# EAGLE design InterfaceBoard (EAGLE 8.2.1)
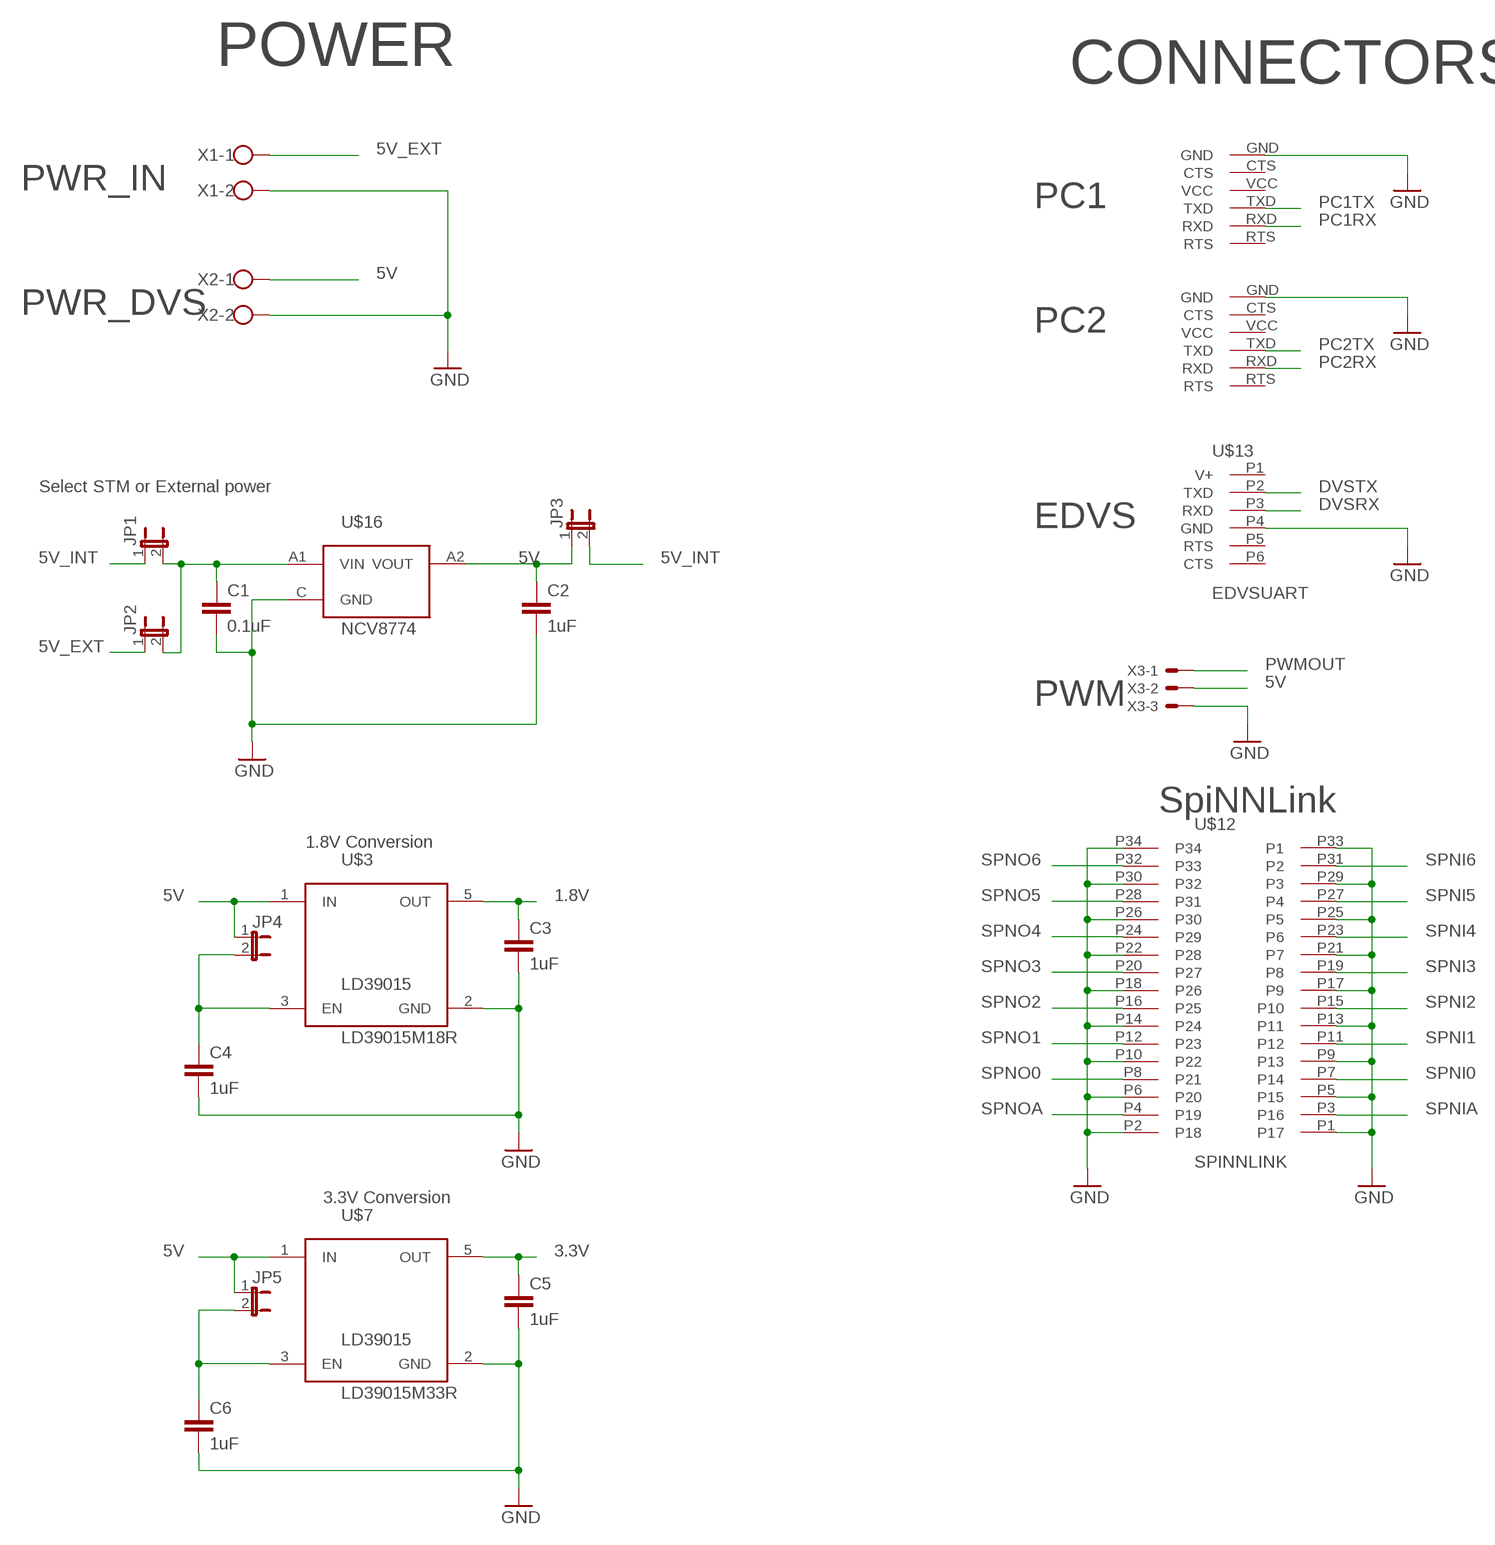
[diagram p0: schematic, sheet 1, part 1 of 2]
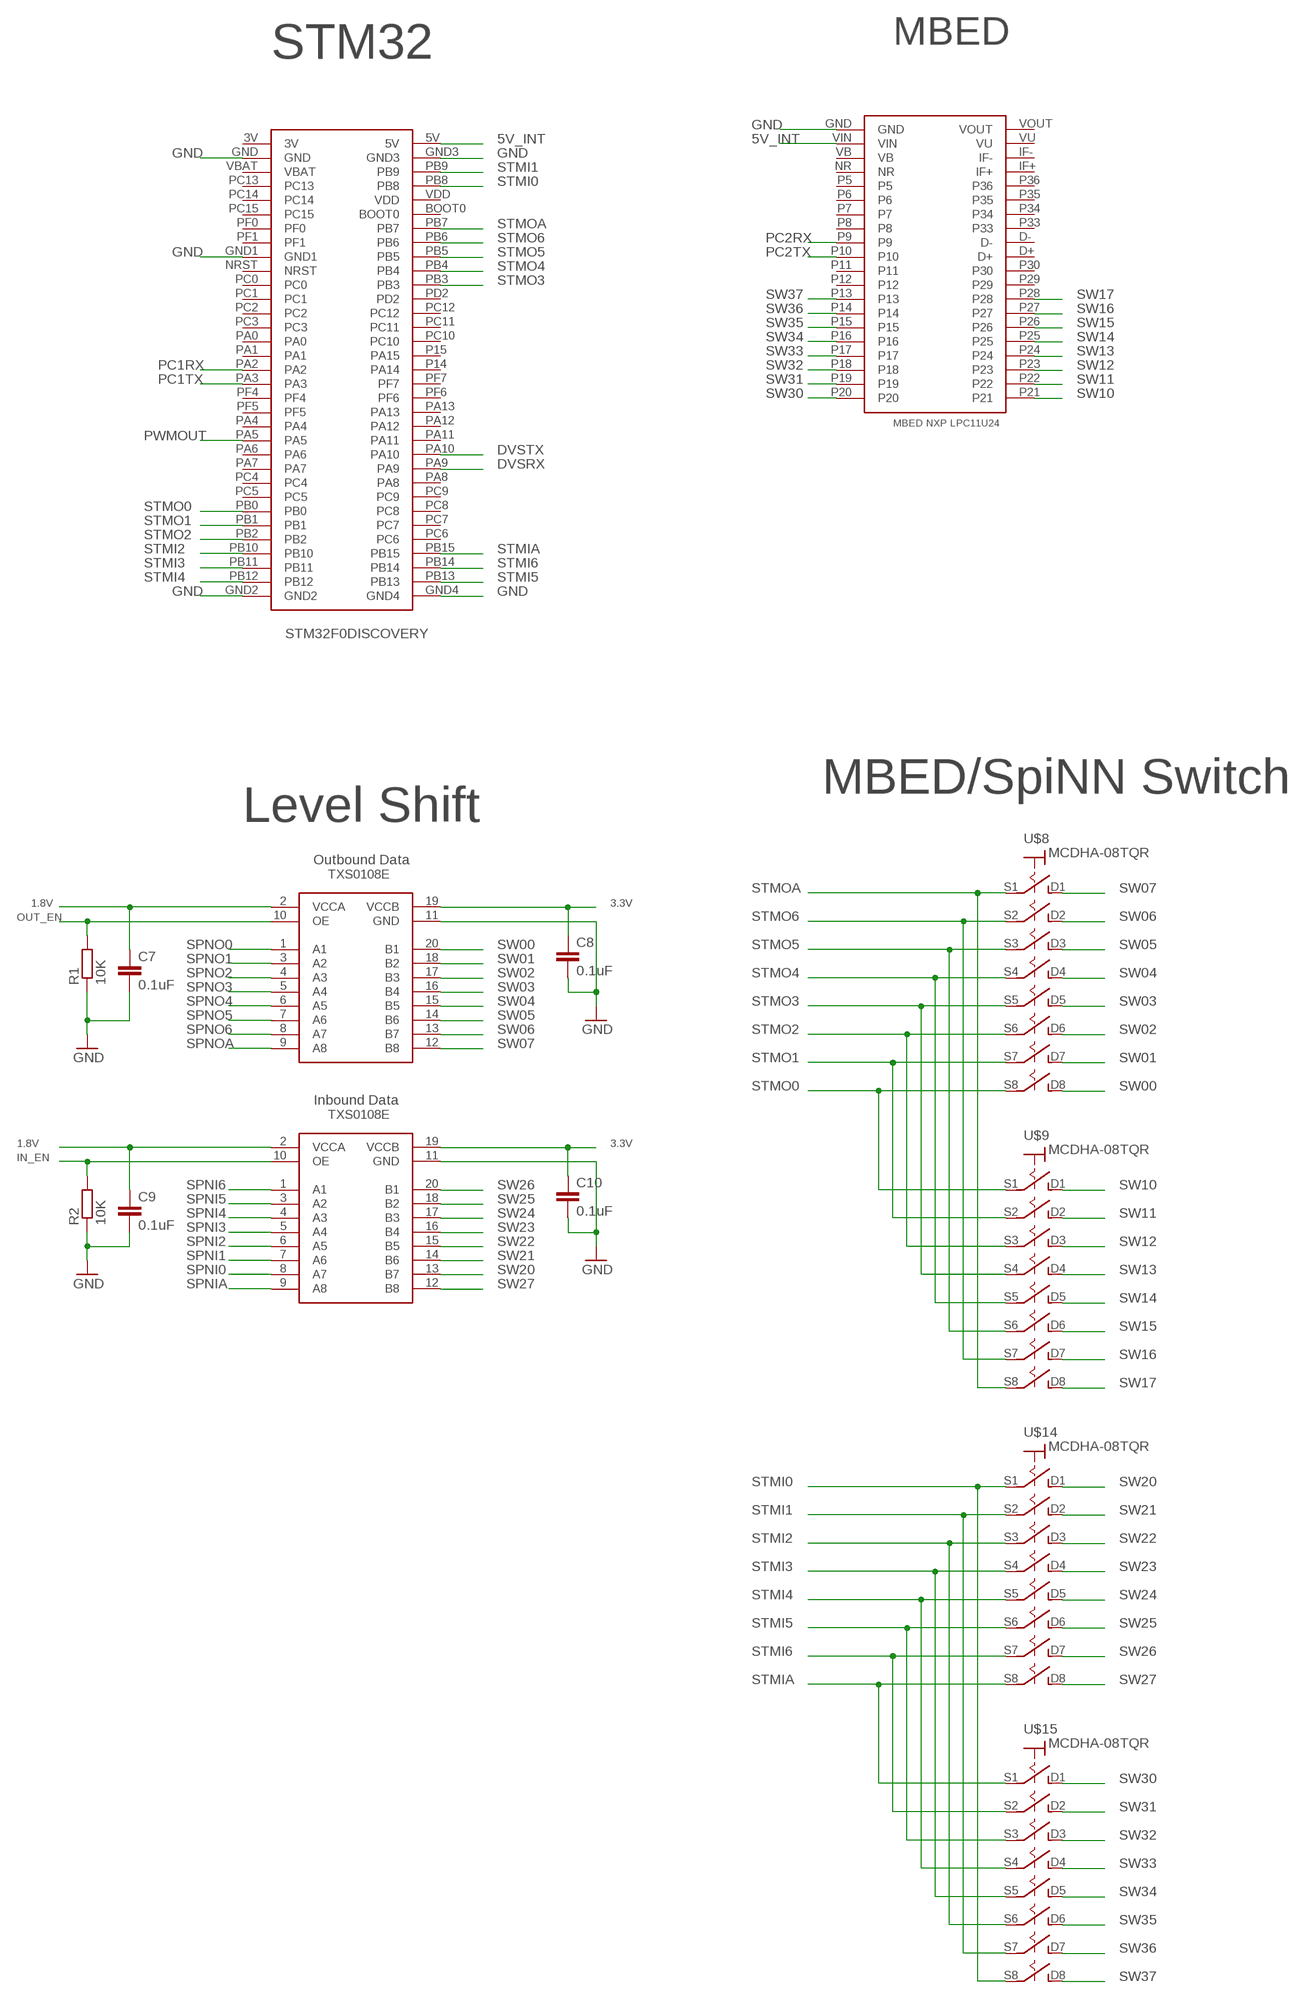
[diagram p1: schematic, sheet 1, part 2 of 2]

## Parts
C1  0.1uF  C2,5-3  [C2.5-3]
C2  1uF  C2,5-3  [C2.5-3]
C3  1uF  C2,5-3  [C2.5-3]
C4  1uF  C2,5-3  [C2.5-3]
C5  1uF  C2,5-3  [C2.5-3]
C6  1uF  C2,5-3  [C2.5-3]
C7  0.1uF  C-EU025-025X050  [C025-025X050]
C8  0.1uF  C-EU025-025X050  [C025-025X050]
C9  0.1uF  C-EU025-025X050  [C025-025X050]
C10  0.1uF  C-EU025-025X050  [C025-025X050]
JP1  JP1E  [JP1]
JP2  JP1E  [JP1]
JP3  JP1E  [JP1]
JP4  JP1E  [JP1]
JP5  JP1E  [JP1]
R1  10K  R-EU_R0805  [R0805]
R2  10K  R-EU_R0805  [R0805]
U$1  STM32F0DISCOVERY  [STM32F0DISCOVERY]
U$2  NCV8774  [DPACK_3]  (not placed on a sheet)
U$3  LD39015M18R  [SOT23-5L]
U$4  LPC11U24  [LPC11U24]
U$5  TXS0108EPWR  [TSSOP20]
U$6  TXS0108EPWR  [TSSOP20]
U$7  LD39015M33R  [SOT23-5L]
U$8  MCDHA-08TQR  [DIPSWITCH8]
U$9  MCDHA-08TQR  [DIPSWITCH8]
U$10  FTDI  [FTDIHEADER]
U$11  FTDI  [FTDIHEADER]
U$12  SPINNLINK  [C42A]
U$13  EDVSUART  [MICROMATCH8]
U$14  MCDHA-08TQR  [DIPSWITCH8]
U$15  MCDHA-08TQR  [DIPSWITCH8]
U$16  NCV8774  [DPACK_3]
X1  W237-102  [W237-102]
X2  W237-102  [W237-102]
X3  KK-156-3  [KK-156-3]

## Nets
1.8V: C3.1 C7.1 C9.1 U$3.5(OUT) U$5.2(VCCA) U$6.2(VCCA)
3.3V: C5.1 C8.1 C10.1 U$5.19(VCCB) U$6.19(VCCB) U$7.5(OUT)
5V: C2.1 JP3.1 JP4.1 JP5.1 U$3.1(IN) U$7.1(IN) U$16.A2(VOUT) X2.1 X3.2
5V_EXT: JP2.1 X1.1
5V_INT: JP1.1 JP3.2 U$1.5V U$4.VIN
DVSRX: U$1.PA9 U$13.P3(RXD)
DVSTX: U$1.PA10 U$13.P2(TXD)
GND: C1.2 C2.2 C3.2 C4.2 C5.2 C6.2 C7.2 C8.2 C9.2 C10.2 R1.1 R2.1 U$1.GND U$1.GND1 U$1.GND2 U$1.GND3 U$1.GND4 U$3.2(GND) U$4.GND U$5.11(GND) U$6.11(GND) U$7.2(GND) U$10.GND U$11.GND U$12.P1(P17) U$12.P2(P18) U$12.P5(P15) U$12.P6(P20) U$12.P9(P13) U$12.P10(P22) U$12.P13(P11) U$12.P14(P24) U$12.P17(P9) U$12.P18(P26) U$12.P21(P7) U$12.P22(P28) U$12.P25(P5) U$12.P26(P30) U$12.P29(P3) U$12.P30(P32) U$12.P33(P1) U$12.P34 U$13.P4(GND) U$16.C(GND) X1.2 X2.2 X3.3
IN_EN: R2.2 U$6.10(OE)
N$1: C1.1 JP1.2 JP2.2 U$16.A1(VIN)
N$2: C4.1 JP4.2 U$3.3(EN)
N$4: C6.1 JP5.2 U$7.3(EN)
OUT_EN: R1.2 U$5.10(OE)
PC1RX: U$1.PA2 U$10.RXD
PC1TX: U$1.PA3 U$10.TXD
PC2RX: U$4.P9 U$11.RXD
PC2TX: U$4.P10 U$11.TXD
PWMOUT: U$1.PA5 X3.1
SPNI0: U$6.8(A7) U$12.P7(P14)
SPNI1: U$6.7(A6) U$12.P11(P12)
SPNI2: U$6.6(A5) U$12.P15(P10)
SPNI3: U$6.5(A4) U$12.P19(P8)
SPNI4: U$6.4(A3) U$12.P23(P6)
SPNI5: U$6.3(A2) U$12.P27(P4)
SPNI6: U$6.1(A1) U$12.P31(P2)
SPNIA: U$6.9(A8) U$12.P3(P16)
SPNO0: U$5.1(A1) U$12.P8(P21)
SPNO1: U$5.3(A2) U$12.P12(P23)
SPNO2: U$5.4(A3) U$12.P16(P25)
SPNO3: U$5.5(A4) U$12.P20(P27)
SPNO4: U$5.6(A5) U$12.P24(P29)
SPNO5: U$5.7(A6) U$12.P28(P31)
SPNO6: U$5.8(A7) U$12.P32(P33)
SPNOA: U$5.9(A8) U$12.P4(P19)
STMI0: U$1.PB8 U$14.S1 U$15.S8
STMI1: U$1.PB9 U$14.S2 U$15.S7
STMI2: U$1.PB10 U$14.S3 U$15.S6
STMI3: U$1.PB11 U$14.S4 U$15.S5
STMI4: U$1.PB12 U$14.S5 U$15.S4
STMI5: U$1.PB13 U$14.S6 U$15.S3
STMI6: U$1.PB14 U$14.S7 U$15.S2
STMIA: U$1.PB15 U$14.S8 U$15.S1
STMO0: U$1.PB0 U$8.S8 U$9.S1
STMO1: U$1.PB1 U$8.S7 U$9.S2
STMO2: U$1.PB2 U$8.S6 U$9.S3
STMO3: U$1.PB3 U$8.S5 U$9.S4
STMO4: U$1.PB4 U$8.S4 U$9.S5
STMO5: U$1.PB5 U$8.S3 U$9.S6
STMO6: U$1.PB6 U$8.S2 U$9.S7
STMOA: U$1.PB7 U$8.S1 U$9.S8
SW00: U$5.20(B1) U$8.D8
SW01: U$5.18(B2) U$8.D7
SW02: U$5.17(B3) U$8.D6
SW03: U$5.16(B4) U$8.D5
SW04: U$5.15(B5) U$8.D4
SW05: U$5.14(B6) U$8.D3
SW06: U$5.13(B7) U$8.D2
SW07: U$5.12(B8) U$8.D1
SW10: U$4.P21 U$9.D1
SW11: U$4.P22 U$9.D2
SW12: U$4.P23 U$9.D3
SW13: U$4.P24 U$9.D4
SW14: U$4.P25 U$9.D5
SW15: U$4.P26 U$9.D6
SW16: U$4.P27 U$9.D7
SW17: U$4.P28 U$9.D8
SW20: U$6.13(B7) U$14.D1
SW21: U$6.14(B6) U$14.D2
SW22: U$6.15(B5) U$14.D3
SW23: U$6.16(B4) U$14.D4
SW24: U$6.17(B3) U$14.D5
SW25: U$6.18(B2) U$14.D6
SW26: U$6.20(B1) U$14.D7
SW27: U$6.12(B8) U$14.D8
SW30: U$4.P20 U$15.D1
SW31: U$4.P19 U$15.D2
SW32: U$4.P18 U$15.D3
SW33: U$4.P17 U$15.D4
SW34: U$4.P16 U$15.D5
SW35: U$4.P15 U$15.D6
SW36: U$4.P14 U$15.D7
SW37: U$4.P13 U$15.D8
Unconnected: U$1.3V U$1.BOOT0 U$1.NRST U$1.P14(PA14) U$1.P15(PA15) U$1.PA0 U$1.PA1 U$1.PA4 U$1.PA6 U$1.PA7 U$1.PA8 U$1.PA11 U$1.PA12 U$1.PA13 U$1.PC0 U$1.PC1 U$1.PC2 U$1.PC3 U$1.PC4 U$1.PC5 U$1.PC6 U$1.PC7 U$1.PC8 U$1.PC9 U$1.PC10 U$1.PC11 U$1.PC12 U$1.PC13 U$1.PC14 U$1.PC15 U$1.PD2 U$1.PF0 U$1.PF1 U$1.PF4 U$1.PF5 U$1.PF6 U$1.PF7 U$1.VBAT U$1.VDD U$2.A1(VIN) U$2.A2(VOUT) U$2.C(GND) U$4.D+ U$4.D- U$4.IF+ U$4.IF- U$4.NR U$4.P5 U$4.P6 U$4.P7 U$4.P8 U$4.P11 U$4.P12 U$4.P29 U$4.P30 U$4.P33 U$4.P34 U$4.P35 U$4.P36 U$4.VB U$4.VOUT U$4.VU U$10.CTS U$10.RTS U$10.VCC U$11.CTS U$11.RTS U$11.VCC U$13.P1(V+) U$13.P5(RTS) U$13.P6(CTS)

## Notes on the sheet
- POWER | CONNECTORS | STM32 | MBED
- PWR_IN
- PC1
- PWR_DVS
- PC2
- Select STM or External power
- EDVS
- PWM
- SpiNNLink
- 1.8V Conversion
- MBED/SpiNN Switch
- Level Shift
- Outbound Data
- 3.3V Conversion
- Inbound Data

## Library data of the parts
C1-C6 = capacitor-wima:C: CAPACITOR naming: grid - package width
C7-C10 = rcl:C-EU: CAPACITOR, European symbol
JP1-JP5 = jumper:JP1E: JUMPER
R1 R2 = rcl:R-EU_: RESISTOR, European symbol
U$1 = InterfaceParts:STM32F0DISCOVERY: STM32F0DISCOVERY Evaluation Board Data Sheet <http://www.st.com/content/ccc/resource/technical/document/user_manual/30/ae/6e/54/d3/b6/46/17/DM00050135.pdf/files/DM00050135.pdf/jcr:content/translations/en.DM00050135.pdf>
U$2 U$16 = InterfaceParts:NCV8774
U$3 = InterfaceParts:LD39015M18R
U$4 = InterfaceParts:LPC11U24
U$5 U$6 = InterfaceParts:TXS0108EPWR
U$7 = InterfaceParts:LD39015M33R
U$8 U$9 U$14 U$15 = InterfaceParts:MCDHA-08TQR
U$10 U$11 = InterfaceParts:FTDI
U$12 = InterfaceParts:SPINNLINK
U$13 = InterfaceParts:EDVSUART
X1 X2 = con-wago-500:W237-102: WAGO SCREW CLAMP; MPN: 237-102; OC_FARNELL: unknown; OC_NEWARK: 70K9898
X3 = con-molex:KK-156-3: KK 156 HEADER Source: http://www.molex.com/pdm_docs/sd/026604100_sd.pdf; OC_FARNELL: unknown; OC_NEWARK: unknown

## Board
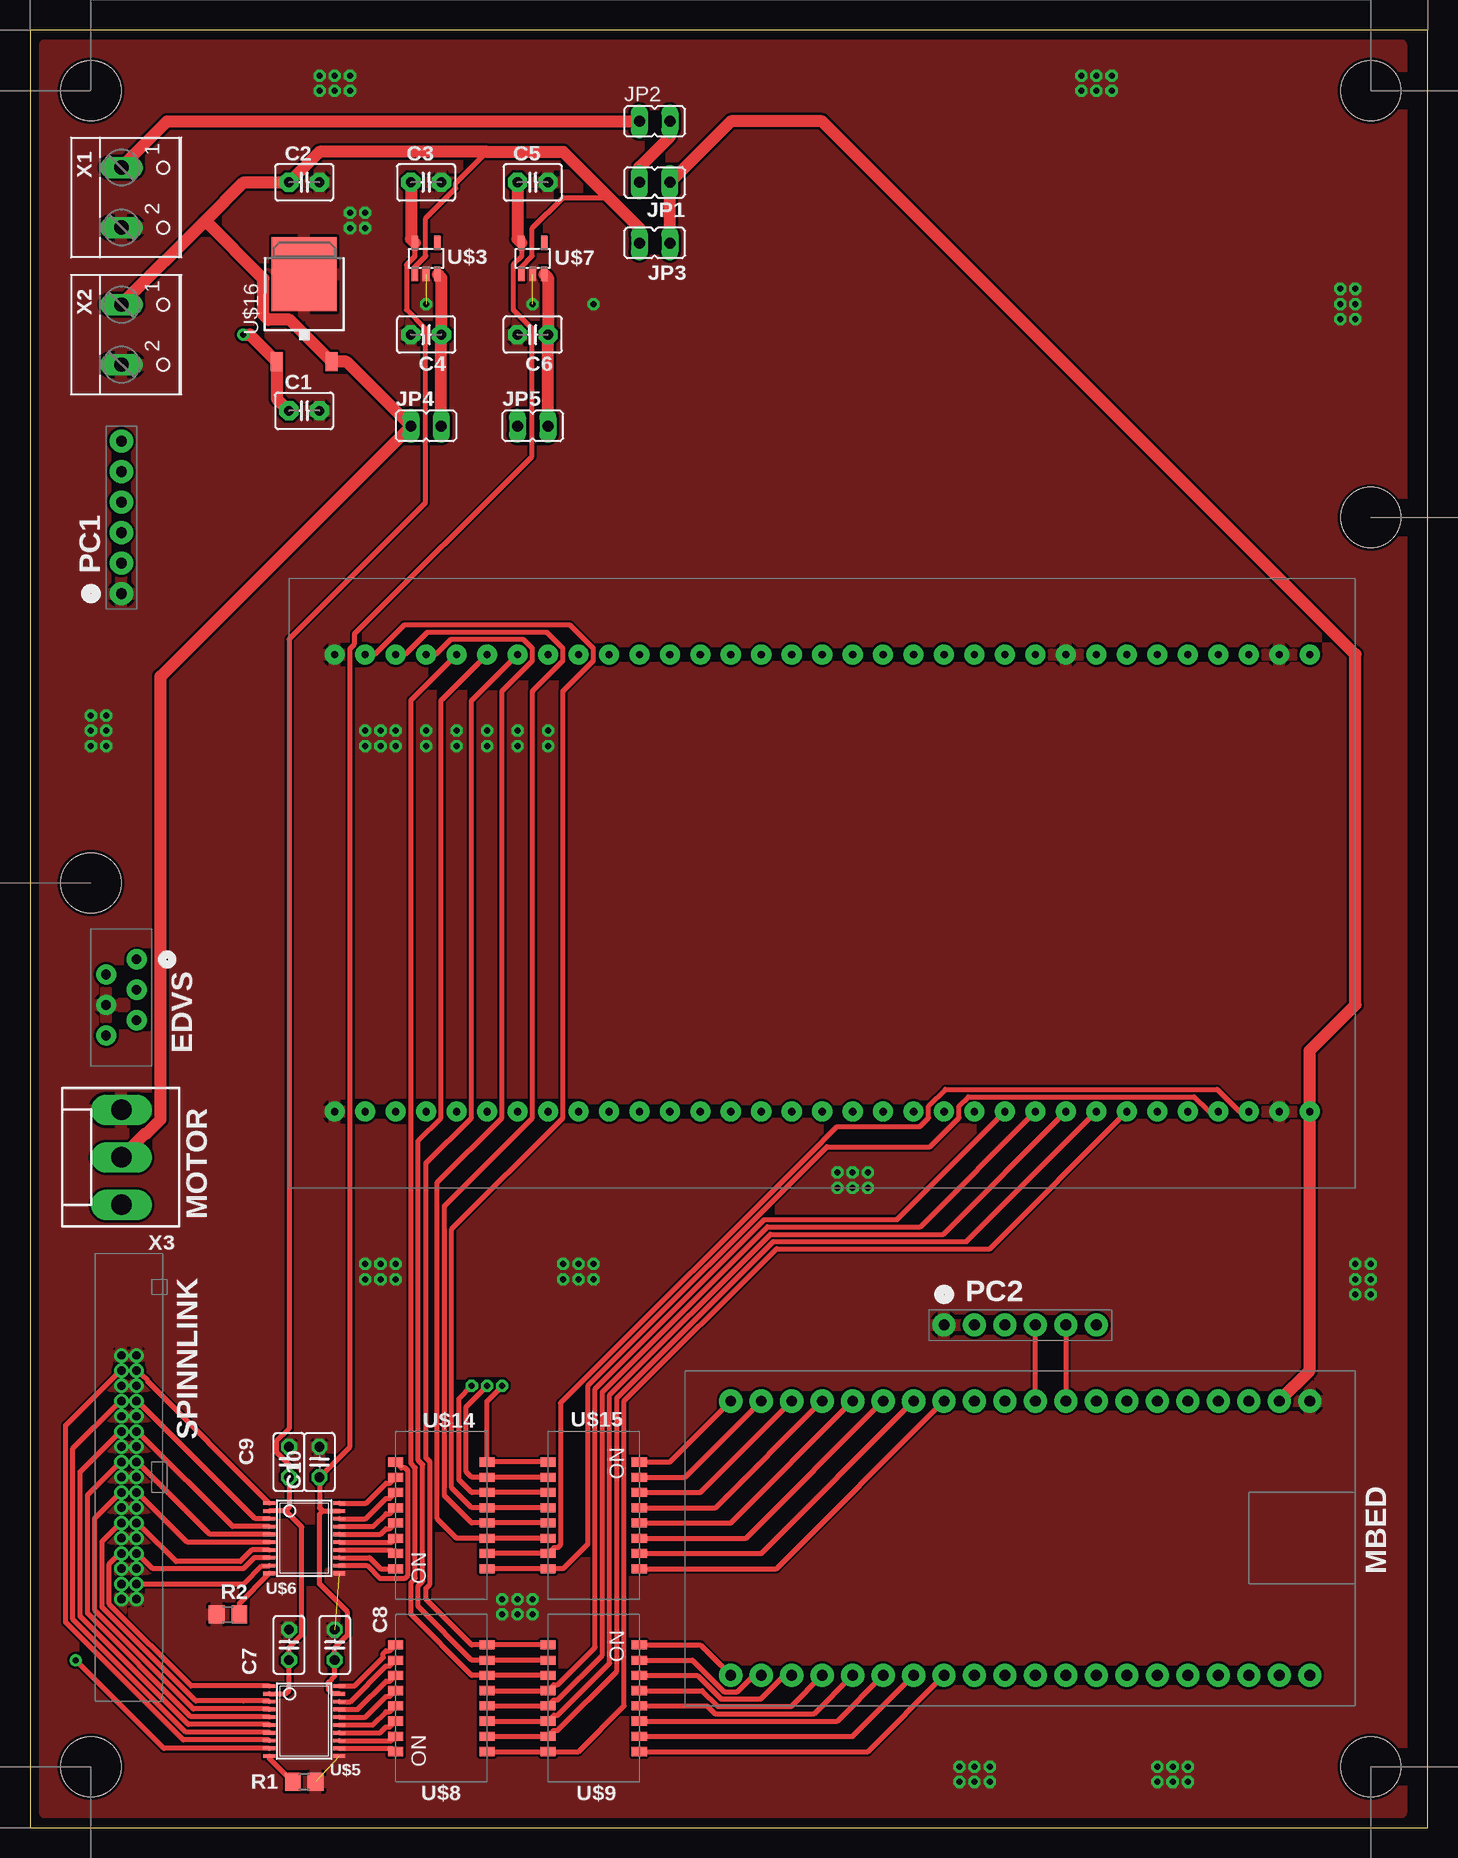
[diagram p2: board, top side]
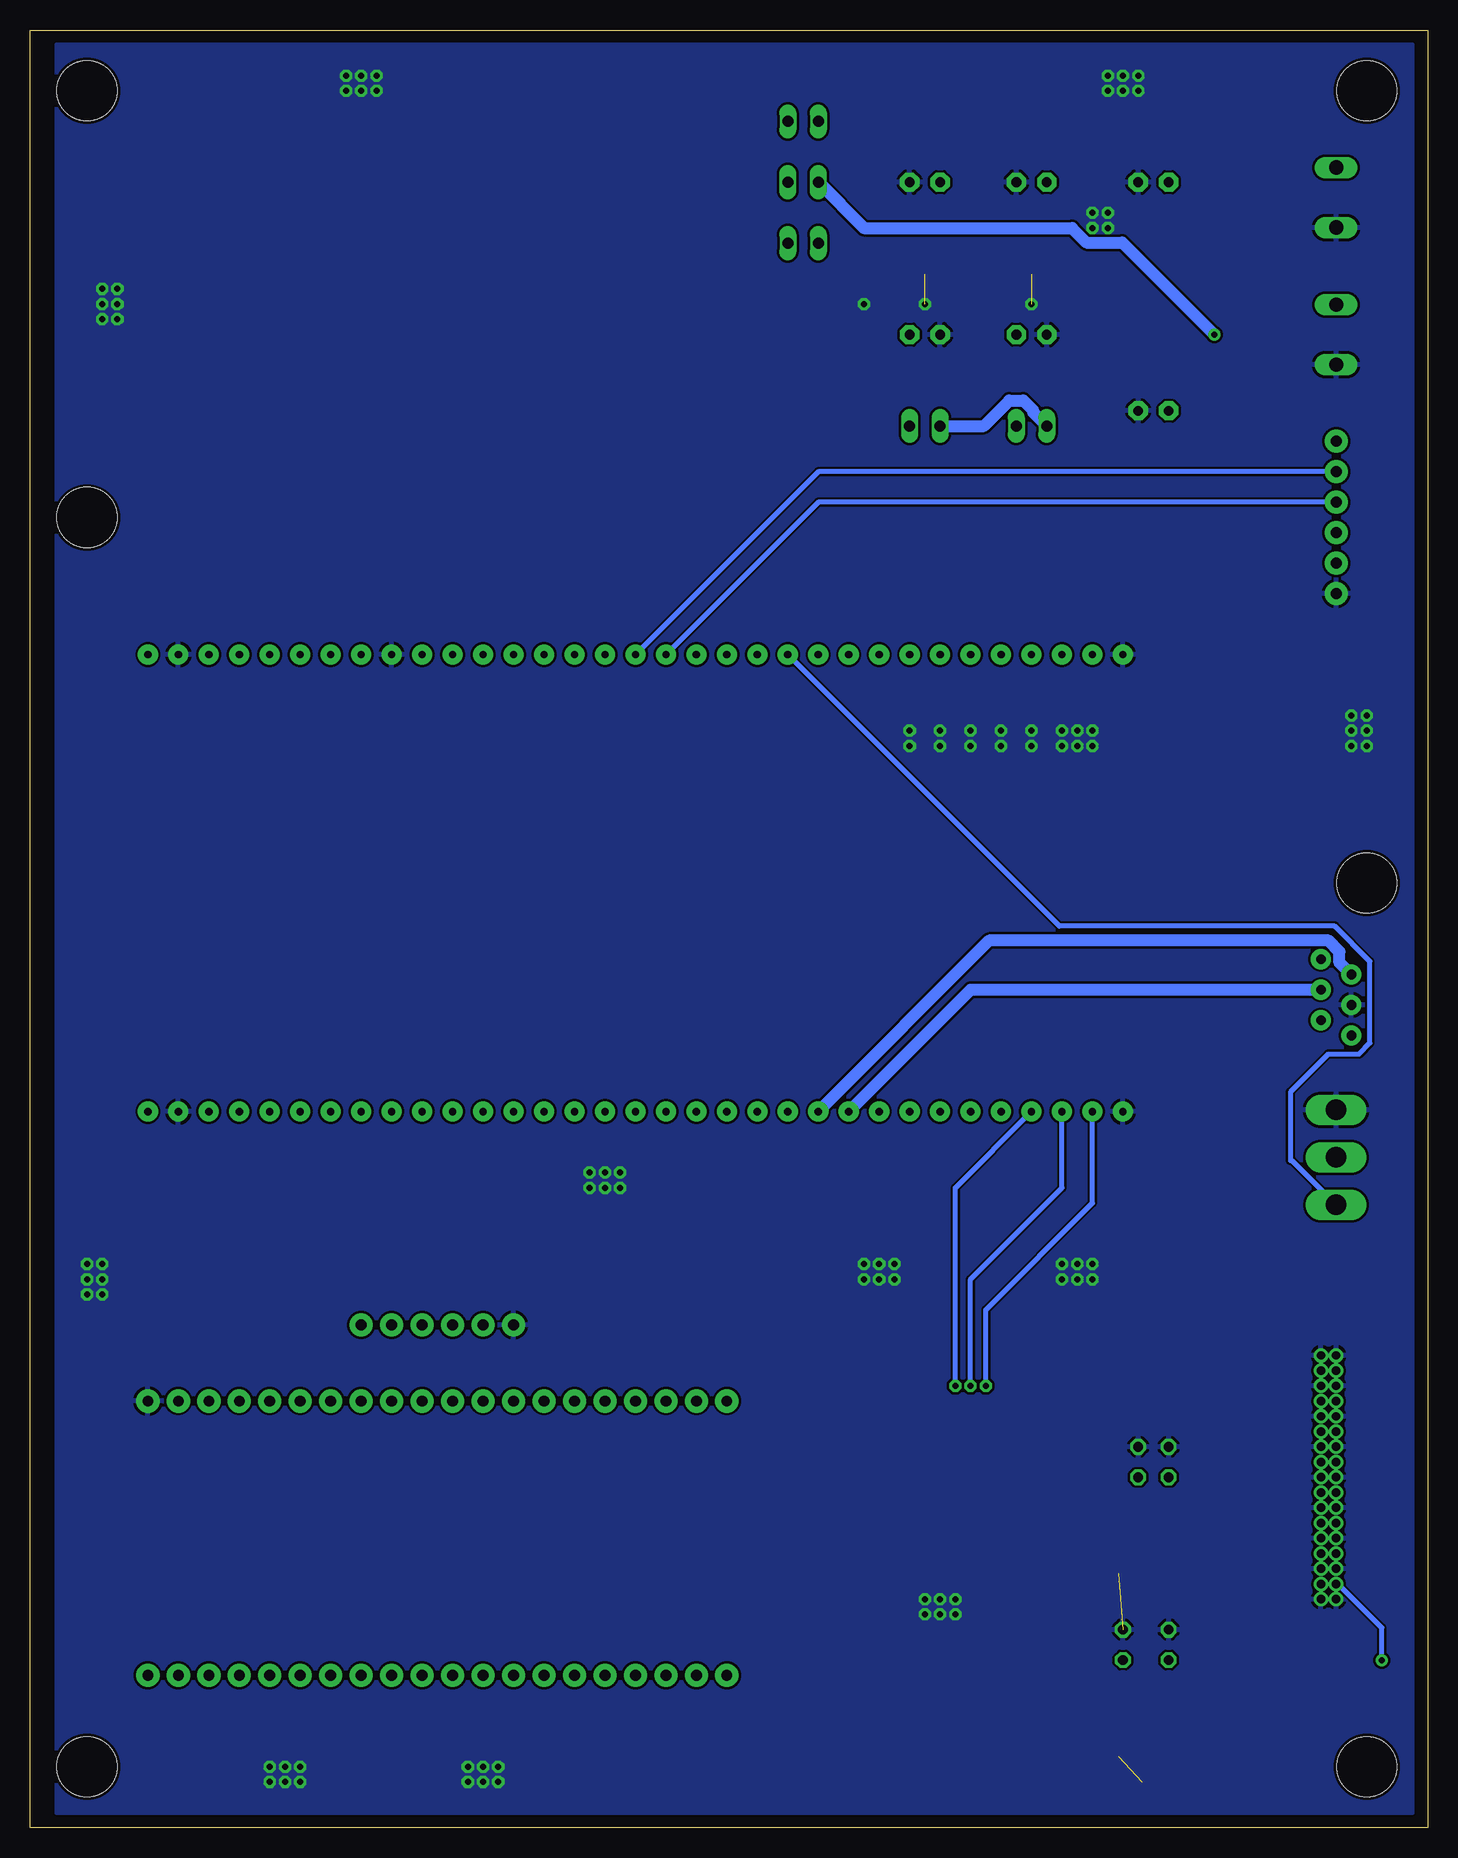
[diagram p3: board, bottom side, seen from below]

Size 116.51 x 149.85 mm. Coordinates in mm from the lower left corner, seen from the top.
Outline: 0,0 116.51,0 116.51,149.85 0,149.85 0,0
Copper layers (1*16): Top 0.035mm / dielectric 1.5mm / Bottom 0.035mm
Design rules "PCBTrain": minimum track width 0.2mm, minimum drill 0.4mm, track to track 0.2mm, track to pad 0.2mm, pad to pad 0.2mm, via to via 0.2mm, smd to smd 0mil, copper to edge 10mil, drill to drill 0.2mm, minimum pad ring 10mil, minimum via ring 10mil, stop-mask expansion 0.125mm, vias tented up to drill 0mil, thermal gap 10mil
Holes 5 mm at 5.08,144.78 5.08,5.08 5.08,78.74 111.76,5.08 111.76,144.78 111.76,109.22

### Footprints (pad centres in the part's own frame; a part is rotated, then mirrored left to right if it is on the bottom)
C2.5-3 = drill 0.813 pad 1.6 octagon: 1 -1.27,0; 2 1.27,0
C025-025X050 = drill 0.813 octagon: 1 -1.27,0; 2 1.27,0
JP1 = drill 0.914 long: 1 0,-1.27; 2 0,1.27
R0805 = smd 1.3 x 1.5: 1 -0.95,0; 2 0.95,0
STM32F0DISCOVERY = drill 0.6 pad 1.676: 3V -20.32,40.64; 5V 17.78,40.64; BOOT0 17.78,27.94; GND 17.78,-40.64; GND1 -20.32,38.1; GND2 -20.32,20.32; GND3 -20.32,-40.64; GND4 17.78,38.1; NRST -20.32,17.78; P14 17.78,0; P15 17.78,2.54; PA0 -20.32,5.08; PA1 -20.32,2.54; PA2 -20.32,0; PA3 -20.32,-2.54; PA4 -20.32,-10.16; PA5 -20.32,-12.7; PA6 -20.32,-15.24; PA7 -20.32,-17.78; PA8 17.78,-20.32; PA9 17.78,-17.78; PA10 17.78,-15.24; PA11 17.78,-12.7; PA12 17.78,-10.16; PA13 17.78,-7.62; PB0 -20.32,-25.4; PB1 -20.32,-27.94; PB2 -20.32,-30.48; PB3 17.78,15.24; PB4 17.78,17.78; PB5 17.78,20.32; PB6 17.78,22.86; PB7 17.78,25.4; PB8 17.78,33.02; PB9 17.78,35.56; PB10 -20.32,-33.02; PB11 -20.32,-35.56; PB12 -20.32,-38.1; PB13 17.78,-38.1; PB14 17.78,-35.56; PB15 17.78,-33.02; PC0 -20.32,15.24; PC1 -20.32,12.7; PC2 -20.32,10.16; PC3 -20.32,7.62; PC4 -20.32,-20.32; PC5 -20.32,-22.86; PC6 17.78,-30.48; PC7 17.78,-27.94; PC8 17.78,-25.4; PC9 17.78,-22.86; PC10 17.78,5.08; PC11 17.78,7.62; PC12 17.78,10.16; PC13 -20.32,33.02; PC14 -20.32,30.48; PC15 -20.32,27.94; PD2 17.78,12.7; PF0 -20.32,25.4; PF1 -20.32,22.86; PF4 -20.32,-5.08; PF5 -20.32,-7.62; PF6 17.78,-5.08; PF7 17.78,-2.54; VBAT -20.32,35.56; VDD 17.78,30.48
SOT23-5L = smd 0.55 x 1.2: 1 -0.95,-1.3; 2 0,-1.3; 3 0.95,-1.3; 4 0.95,1.3; 5 -0.95,1.3
LPC11U24 = drill 0.9 pad 1.93: D+ 11.43,1.27; D- 11.43,3.81; GND -11.43,24.13; IF+ 11.43,16.51; IF- 11.43,19.05; NR -11.43,16.51; P5 -11.43,13.97; P6 -11.43,11.43; P7 -11.43,8.89; P8 -11.43,6.35; P9 -11.43,3.81; P10 -11.43,1.27; P11 -11.43,-1.27; P12 -11.43,-3.81; P13 -11.43,-6.35; P14 -11.43,-8.89; P15 -11.43,-11.43; P16 -11.43,-13.97; P17 -11.43,-16.51; P18 -11.43,-19.05; P19 -11.43,-21.59; P20 -11.43,-24.13; P21 11.43,-24.13; P22 11.43,-21.59; P23 11.43,-19.05; P24 11.43,-16.51; P25 11.43,-13.97; P26 11.43,-11.43; P27 11.43,-8.89; P28 11.43,-6.35; P29 11.43,-3.81; P30 11.43,-1.27; P33 11.43,6.35; P34 11.43,8.89; P35 11.43,11.43; P36 11.43,13.97; VB -11.43,19.05; VIN -11.43,21.59; VOUT 11.43,24.13; VU 11.43,21.59
TSSOP20 = smd 0.305 x 0.991: 1 -2.925,-2.918; 2 -2.275,-2.918; 3 -1.625,-2.918; 4 -0.975,-2.918; 5 -0.325,-2.918; 6 0.325,-2.918; 7 0.975,-2.918; 8 1.625,-2.918; 9 2.275,-2.918; 10 2.925,-2.918; 11 2.925,2.918; 12 2.275,2.918; 13 1.625,2.918; 14 0.975,2.918; 15 0.325,2.918; 16 -0.325,2.918; 17 -0.975,2.918; 18 -1.625,2.918; 19 -2.275,2.918; 20 -2.925,2.918
DIPSWITCH8 = smd 0.76 x 1.27: D1 -3.81,3.81; D2 -2.54,3.81; D3 -1.27,3.81; D4 0,3.81; D5 1.27,3.81; D6 2.54,3.81; D7 3.81,3.81; D8 5.08,3.81; S1 -3.81,-3.81; S2 -2.54,-3.81; S3 -1.27,-3.81; S4 0,-3.81; S5 1.27,-3.81; S6 2.54,-3.81; S7 3.81,-3.81; S8 5.08,-3.81
FTDIHEADER = drill 0.9 pad 1.93: CTS 3.81,0; GND 6.35,0; RTS -6.35,0; RXD -3.81,0; TXD -1.27,0; VCC 1.27,0
C42A = drill 0.7 pad 0.95: P1 10.16,1.27; P2 10.16,0; P3 8.89,1.27; P4 8.89,0; P5 7.62,1.27; P6 7.62,0; P7 6.35,1.27; P8 6.35,0; P9 5.08,1.27; P10 5.08,0; P11 3.81,1.27; P12 3.81,0; P13 2.54,1.27; P14 2.54,0; P15 1.27,1.27; P16 1.27,0; P17 0,1.27; P18 0,0; P19 -1.27,1.27; P20 -1.27,0; P21 -2.54,1.27; P22 -2.54,0; P23 -3.81,1.27; P24 -3.81,0; P25 -5.08,1.27; P26 -5.08,0; P27 -6.35,1.27; P28 -6.35,0; P29 -7.62,1.27; P30 -7.62,0; P31 -8.89,1.27; P32 -8.89,0; P33 -10.16,1.27; P34 -10.16,0
MICROMATCH8 = drill 0.8 pad 1.676: P1 5.08,-2.54; P2 3.81,0; P3 2.54,-2.54; P4 1.27,0; P5 0,-2.54; P6 -1.27,0
DPACK_3 = smd 1 x 1.6: A1 -2.28,-4.8; A2 2.28,-4.8 | smd 5.4 x 6.2: C 0,2.5
W237-102 = drill 1.194 long: 1 -2.5,-1.27; 2 2.5,-1.27
KK-156-3 = drill 1.7 pad 2.184 long: 1 -3.96,0; 2 0,0; 3 3.96,0

### Placement (x,y rotation side)
C1  22.86,118.11 0 top
C2  22.86,137.16 0 top
C3  33.02,137.16 0 top
C4  33.02,124.46 180 top
C5  41.91,137.16 0 top
C6  41.91,124.46 180 top
C7  21.59,15.24 90 top
C8  25.4,15.24 90 top
C9  21.59,30.48 90 top
C10  24.13,30.48 90 top
JP1  52.07,137.16 90 top
JP2  52.07,142.24 270 top
JP3  52.07,132.08 270 top
JP4  33.02,116.84 270 top
JP5  41.91,116.84 270 top
R1  22.86,3.81 180 top
R2  16.51,17.78 0 top
U$1  66.04,77.47 270 top
U$3  33.02,130.81 0 top
U$4  82.55,24.13 270 top
U$5  22.86,8.89 270 top
U$6  22.86,24.13 270 top
U$7  41.91,130.81 0 top
U$8  34.29,10.16 90 top
U$9  46.99,11.43 270 top
U$10  7.62,109.22 270 top
U$11  82.55,41.91 180 top
U$12  7.62,29.21 270 top
U$13  6.35,67.31 90 top
U$14  34.29,25.4 90 top
U$15  46.99,26.67 270 top
U$16  22.86,127 0 top
X1  8.89,135.89 270 top
X2  8.89,124.46 270 top
X3  7.62,55.88 90 top

### Tracks (layer width: path | path; a pad name or v marks a point on that pad's centre or on a via)
1.8V
  Top 0.406: 21.32,26.41 U$6.2 | 21.32,26.41 21.59,26.67 C9.1 21.59,30.25 20.53,31.31 20.53,32.19 21.59,33.25 21.59,99.06 32.95,110.42 32.95,124.96 31.39,126.52 31.39,130.28 32.07,130.96 U$3.5 | U$5.2 21.32,11.16 21.59,11.43 C7.1 21.59,15.01 22.65,16.07 22.65,25.08 21.32,26.41
  Top 1.016: C3.1 31.75,132.43 U$3.5
3.3V
  Top 0.406: 24.39,26.41 U$6.19 | 24.39,26.41 24.13,26.67 C10.1 26.67,31.75 26.67,98.28 27.06,98.67 27.06,99.52 41.84,114.3 41.84,124.96 40.28,126.52 40.28,130.28 40.96,130.96 U$7.5 | 24.39,26.41 24.13,26.14 24.13,20.32 26.46,17.99 26.46,16.07 25.4,15.01 C8.1 25.4,12.65 24.88,12.13 24.88,11.5 25.21,11.16 U$5.19
  Top 1.016: C5.1 40.64,132.43 U$7.5
5V
  Top 0.406: U$3.1 32.07,130.1 32.98,131.01 32.98,134.15 35.49,136.66 35.49,137.09 38.1,139.7 | U$7.1 40.96,130.1 41.87,131.01 41.87,133.31 44.45,135.89 48.26,135.89
  Top 1.016: JP3.1 50.8,133.35 48.26,135.89 44.45,139.7 38.1,139.7 24.13,139.7 C2.1 17.82,137.16 14.62,133.97 | 14.62,133.97 X2.1 | X3.2 9.6,57.86 9.72,57.86 10.88,59.02 10.88,95.97 JP4.1 26.39,122.2 U$16.A2 21.65,125.69 19.87,125.69 19.45,126.11 19.45,129.14 14.62,133.97
  Bottom 1.016: JP5.1 37.01,116.84 34.88,118.97 33.7,118.97 32.87,118.14 32.87,117.96 JP4.1
5V_EXT
  Top 1.016: X1.1 7.62,138.43 11.43,142.24 JP2.1
5V_INT
  Top 1.016: JP3.2 JP1.1 58.42,142.24 66.04,142.24 110.49,97.79 110.49,68.58 106.68,64.77 U$1.5V 106.68,38.1 U$4.VIN
DVSRX
  Bottom 1.016: U$13.P3 38.1,69.85 U$1.PA9
DVSTX
  Bottom 1.016: U$13.P2 7.34,72.11 7.34,73.03 8.25,73.94 36.55,73.94 U$1.PA10
GND  (via drill 0.5)  (4 unrouted)
  other vias: 46.99,127 26.67,133.35 26.67,134.62 27.94,134.62 27.94,133.35 33.02,127 41.91,127 44.45,46.99 45.72,46.99 46.99,46.99 44.45,45.72 45.72,45.72 46.99,45.72 29.21,46.99 30.48,46.99 27.94,46.99 27.94,45.72 30.48,45.72 29.21,45.72 29.21,91.44 30.48,91.44 30.48,90.17 29.21,90.17 27.94,90.17 27.94,91.44 67.31,54.61 68.58,54.61 69.85,54.61 69.85,53.34 68.58,53.34 67.31,53.34 33.02,91.44 33.02,90.17 35.56,90.17 35.56,91.44 38.1,90.17 38.1,91.44 40.64,90.17 40.64,91.44 43.18,90.17 43.18,91.44 39.37,19.05 40.64,19.05 41.91,19.05 39.37,17.78 40.64,17.78 41.91,17.78 77.47,5.08 78.74,5.08 80.01,5.08 77.47,3.81 78.74,3.81 80.01,3.81 93.98,5.08 95.25,5.08 96.52,5.08 93.98,3.81 95.25,3.81 96.52,3.81 110.49,44.45 110.49,45.72 110.49,46.99 111.76,44.45 111.76,45.72 111.76,46.99 109.22,125.73 109.22,127 109.22,128.27 110.49,125.73 110.49,127 110.49,128.27 90.17,144.78 88.9,144.78 87.63,144.78 90.17,146.05 88.9,146.05 87.63,146.05 24.13,146.05 25.4,146.05 26.67,146.05 24.13,144.78 25.4,144.78 26.67,144.78 5.08,92.71 5.08,91.44 5.08,90.17 6.35,92.71 6.35,91.44 6.35,90.17
  pour Top: 1.27,148.59 114.3,148.59 114.3,1.27 1.27,1.27
  pour Bottom: 1.27,148.59 114.3,148.59 114.3,1.27 1.27,1.27
IN_EN
  Top 0.406: R2.2 17.46,18.72 U$6.10
N$1  (via drill 0.5)
  Top 1.016: JP2.2 53.34,140.97 50.8,138.43 JP1.2 | v17.78,124.46 18.32,124.46 U$16.A1 20.58,119.12 C1.1
  Bottom 1.016: JP1.2 46.99,133.35 29.65,133.35 28.44,132.14 25.46,132.14 v17.78,124.46
N$2
  Top 0.406: U$3.3 34.29,129.19
  Top 1.016: 34,129.48 34.29,129.19 C4.1 JP4.2
N$4
  Top 0.406: U$7.3 43.18,129.19
  Top 1.016: 42.89,129.48 43.18,129.19 C6.1 JP5.2
OUT_EN
  Top 0.406: U$5.10 19.94,5.78 R1.2
PC1RX
  Bottom 0.406: U$10.RXD 50.8,113.03 U$1.PA2
PC1TX
  Bottom 0.406: U$10.TXD 50.8,110.49 U$1.PA3
PC2RX
  Top 0.406: U$11.RXD U$4.P9
PC2TX
  Top 0.406: U$4.P10 U$11.TXD
PWMOUT
  Bottom 0.406: U$1.PA5 30.7,75.15 7.75,75.15 4.8,72.21 4.8,65.4 5.71,64.49 8.26,64.49 11.43,61.32 11.43,55.61 11.31,55.61 X3.1
SPNI0
  Top 0.406: U$6.8 18.7,22.5 17.78,21.59 10.24,21.59 9.29,22.55 9.2,22.55 U$12.P7
SPNI1
  Top 0.406: U$6.7 18.49,23.16 17.53,22.2 12.18,22.2 9.29,25.09 9.2,25.09 U$12.P11
SPNI2
  Top 0.406: U$12.P15 9.2,27.63 9.29,27.63 13.11,23.8 U$6.6
SPNI3
  Top 0.406: U$12.P19 9.2,30.17 9.29,30.17 15,24.45 U$6.5
SPNI4
  Top 0.406: U$12.P23 9.2,32.71 9.29,32.71 16.89,25.11 U$6.4
SPNI5
  Top 0.406: U$12.P27 9.2,35.25 9.29,35.25 18.78,25.75 U$6.3
SPNI6
  Top 0.406: U$12.P31 9.2,37.79 9.29,37.79 9.85,37.23 9.85,37.15 U$6.1
SPNIA
  Top 0.406: U$6.9 19.9,21.81 19.33,21.81 17.84,20.32 U$12.P3
SPNO0
  Top 0.406: U$12.P8 7.36,22.6 7.2,22.6 6.61,22.01 6.61,18.63 13.43,11.81 U$5.1
SPNO1
  Top 0.406: U$5.3 19.9,10.56 17.78,10.56 13.83,10.56 6.01,18.38 6.01,23.87 7.22,25.09 7.31,25.09 U$12.P12
SPNO2
  Top 0.406: U$5.4 19.9,9.91 13.62,9.91 5.4,18.13 5.4,25.8 7.22,27.63 7.31,27.63 U$12.P16
SPNO3
  Top 0.406: U$5.5 19.9,9.26 13.41,9.26 4.79,17.88 4.79,27.74 7.22,30.17 7.31,30.17 U$12.P20
SPNO4
  Top 0.406: U$5.6 19.9,8.61 13.21,8.61 4.19,17.63 4.19,29.67 7.22,32.71 7.31,32.71 U$12.P24
SPNO5
  Top 0.406: U$5.7 19.9,7.96 13,7.96 3.58,17.38 3.58,31.6 7.22,35.25 7.31,35.25 U$12.P28
SPNO6
  Top 0.406: U$5.8 19.9,7.31 12.79,7.31 2.97,17.13 2.97,33.54 7.22,37.79 7.31,37.79 U$12.P32
SPNOA  (via drill 0.5)
  Top 0.406: U$5.9 11.16,6.62 v3.81,13.97
  Bottom 0.406: U$12.P4 7.36,20.06 7.2,20.06 3.81,16.66 v3.81,13.97
STMI0
  Top 0.406: U$14.S1 U$15.S8 44.45,21.59 46.5,23.64 46.5,36.82 66.44,56.75 | U$1.PB8 98.28,59.69 97.03,60.93 78.23,60.93 77.44,60.15 77.44,59.18 75.02,56.75 66.44,56.75 | 66.45,56.77 66.44,56.75
STMI1
  Top 0.406: U$14.S2 U$15.S7 43.67,23.35 43.98,23.35 44.22,23.58 44.22,35.39 66.01,57.18 | 66.2,57.37 66.01,57.18 | U$1.PB9 100.82,59.69 98.97,61.54 76.29,61.54 74.9,60.15 74.9,59.18 74.17,58.45 67.27,58.45 66.2,57.37 | 66.01,57.18 66.2,57.37
STMI2
  Top 0.406: U$15.S6 U$14.S3 35.56,24.13 33.94,25.75 33.94,53.78 39.34,59.18 39.34,94.74 41.88,97.28 41.88,98.3 41.15,99.03 35.05,99.03 33.8,97.79 U$1.PB10
STMI3
  Top 0.406: U$15.S5 U$14.S4 36.83,25.4 34.55,27.68 34.55,51.84 41.88,59.18 41.88,94.74 44.42,97.28 44.42,98.3 43.09,99.64 33.11,99.64 31.26,97.79 U$1.PB11
STMI4
  Top 0.406: U$15.S4 U$14.S5 36.83,26.67 35.16,28.34 35.16,49.91 44.42,59.18 44.42,94.74 46.96,97.28 46.96,98.3 45.02,100.24 31.18,100.24 28.72,97.79 U$1.PB12
STMI5  (via drill 0.5)
  Top 0.406: U$15.S3 U$14.S6 36.83,27.94 35.76,29.01 35.76,35.76 v36.83,36.83
  Bottom 0.406: v36.83,36.83 36.83,43.18 27.94,52.07 U$1.PB13
STMI6  (via drill 0.5)
  Top 0.406: U$15.S2 U$14.S7 36.83,29.21 36.37,29.67 36.37,35.09 37.74,36.45 37.74,36.47 v38.1,36.83
  Bottom 0.406: v38.1,36.83 38.1,45.72 30.48,53.34 U$1.PB14
STMIA  (via drill 0.5)
  Top 0.406: U$15.S1 U$14.S8 38.1,35.55 39.01,36.45 39.01,36.47 v39.37,36.83
  Bottom 0.406: v39.37,36.83 39.37,53.34 U$1.PB15
STMO0
  Top 0.406: U$9.S1 U$8.S8 36.83,15.24 33.02,19.05 33.02,19.97 33.34,20.29 33.34,30.51 33.02,30.83 33.02,55.39 36.8,59.18 36.8,93.95 U$1.PB0
STMO1
  Top 0.406: U$9.S2 U$8.S7 36.83,13.97 32.36,18.44 32.36,20.17 32.73,20.54 32.73,30.26 32.36,30.63 32.36,57.27 34.26,59.18 34.26,93.95 U$1.PB1
STMO2
  Top 0.406: U$9.S3 U$8.S6 36.83,12.7 31.75,17.78 31.75,20.42 32.12,20.79 32.12,30.01 31.75,30.38 31.75,93.98 U$1.PB2
STMO3
  Top 0.406: U$8.S5 U$9.S4 43.67,11.92 43.98,11.92 47.1,15.04 47.1,36.56 61.23,50.69 72.28,50.69 U$1.PB3
STMO4
  Top 0.406: U$8.S4 U$9.S5 43.67,10.65 43.98,10.65 47.71,14.38 47.71,36.31 61.48,50.08 74.21,50.08 U$1.PB4
STMO5
  Top 0.406: U$8.S3 U$9.S6 43.67,9.38 43.98,9.38 48.32,13.71 48.32,36.06 61.73,49.47 76.14,49.47 U$1.PB5
STMO6
  Top 0.406: U$8.S2 U$9.S7 43.67,8.11 43.98,8.11 48.92,13.05 48.92,35.81 61.98,48.87 78.08,48.87 U$1.PB6
STMOA
  Top 0.406: U$8.S1 U$9.S8 45.72,6.35 49.53,10.16 49.53,35.56 62.23,48.26 80.01,48.26 U$1.PB7
SW00
  Top 0.406: U$5.20 27.05,11.81 29.44,14.2 29.44,14.52 29.68,14.75 29.99,14.75 U$8.D8
SW01
  Top 0.406: U$8.D7 29.99,13.48 29.68,13.48 26.71,10.52 U$5.18
SW02
  Top 0.406: U$8.D6 29.99,12.21 29.68,12.21 27.33,9.87 U$5.17
SW03
  Top 0.406: U$8.D5 29.99,10.94 29.68,10.94 27.95,9.21 U$5.16
SW04
  Top 0.406: U$8.D4 29.99,9.67 29.68,9.67 28.57,8.56 U$5.15
SW05
  Top 0.406: U$8.D3 29.99,8.4 29.68,8.4 29.19,7.92 U$5.14
SW06
  Top 0.406: U$5.13 30.12,7.26 U$8.D2
SW07
  Top 0.406: U$5.12 30.21,6.62 U$8.D1
SW10
  Top 0.406: U$9.D1 55.88,15.24 U$4.P21
SW11
  Top 0.406: U$9.D2 55.22,13.97 57.85,11.33 58.99,11.33 60.35,12.7 U$4.P22
SW12
  Top 0.406: U$9.D3 55.63,12.7 57.6,10.72 60.92,10.72 62.9,12.7 U$4.P23
SW13
  Top 0.406: U$9.D4 56.04,11.43 57.35,10.12 63.46,10.12 U$4.P24
SW14
  Top 0.406: U$9.D5 56.45,10.16 57.1,9.51 65.39,9.51 U$4.P25
SW15
  Top 0.406: U$9.D6 67.31,8.89 U$4.P26
SW16
  Top 0.406: U$9.D7 68.58,7.62 U$4.P27
SW17
  Top 0.406: U$9.D8 69.85,6.35 U$4.P28
SW20
  Top 0.406: U$6.13 28.3,22.5 29.21,21.59 U$14.D1
SW21
  Top 0.406: U$6.14 30.18,23.16 U$14.D2
SW22
  Top 0.406: U$6.15 30.16,23.8 U$14.D3
SW23
  Top 0.406: U$14.D4 29.99,24.91 29.68,24.91 29.22,24.45 U$6.16
SW24
  Top 0.406: U$14.D5 29.99,26.18 29.68,26.18 28.6,25.11 U$6.17
SW25
  Top 0.406: U$14.D6 29.99,27.45 29.68,27.45 27.98,25.75 U$6.18
SW26
  Top 0.406: U$14.D7 29.99,28.72 29.68,28.72 28.01,27.05 U$6.20
SW27
  Top 0.406: U$6.12 28.09,21.86 29.14,20.81 31.28,20.81 31.52,21.04 31.52,29.76 31.28,29.99 30.97,29.99 U$14.D8
SW30
  Top 0.406: U$15.D1 53.34,30.48 U$4.P20
SW31
  Top 0.406: U$15.D2 54.61,29.21 U$4.P19
SW32
  Top 0.406: U$15.D3 55.88,27.94 U$4.P18
SW33
  Top 0.406: U$15.D4 57.15,26.67 U$4.P17
SW34
  Top 0.406: U$15.D5 58.42,25.4 U$4.P16
SW35
  Top 0.406: U$15.D6 59.69,24.13 U$4.P15
SW36
  Top 0.406: U$15.D7 60.96,22.86 U$4.P14
SW37
  Top 0.406: U$15.D8 62.23,21.59 U$4.P13

### Text on the board
tNames: PC1 | EDVS | MOTOR | PC2 | SPINNLINK | MBED